# Altium schematic sheet Main.SchDoc
size A4; SheetNumber: 1; SheetTotal: 4
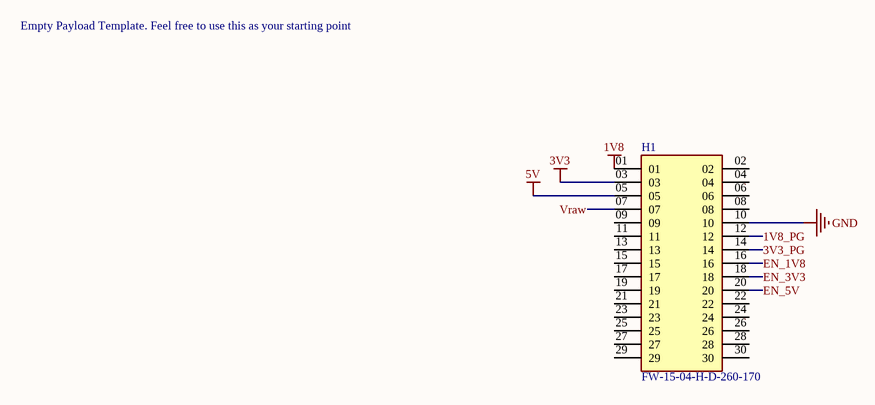
[diagram p0: Main.SchDoc]

## Parts
H1  FW-15-04-H-D-260-170  [SAMTEC_FW-15-04-H-D-260-170]

## Nets
1V8: H1.01
3V3: H1.03
5V: H1.05
GND: H1.10
1V8_PG: H1.12
3V3_PG: H1.14
EN_1V8: H1.16
EN_3V3: H1.18
EN_5V: H1.20
Vraw: H1.07

Not connected (* = marked no-connect by the designer): H1 02 04 06 08 09 11 13 15 17 19 21 22 23 24 25 26 27 28 29 30

## Notes on the sheet
- Empty Payload Template. Feel free to use this as your starting point

## Library data of the parts
H1 = FW-15-04-H-D-260-170: MF: Samtec; Value: *; Availability: Unavailable; Package: None; MP: FW-15-04-H-D-260-170; Price: None